# EAGLE schematic spinac (EAGLE 6.3)
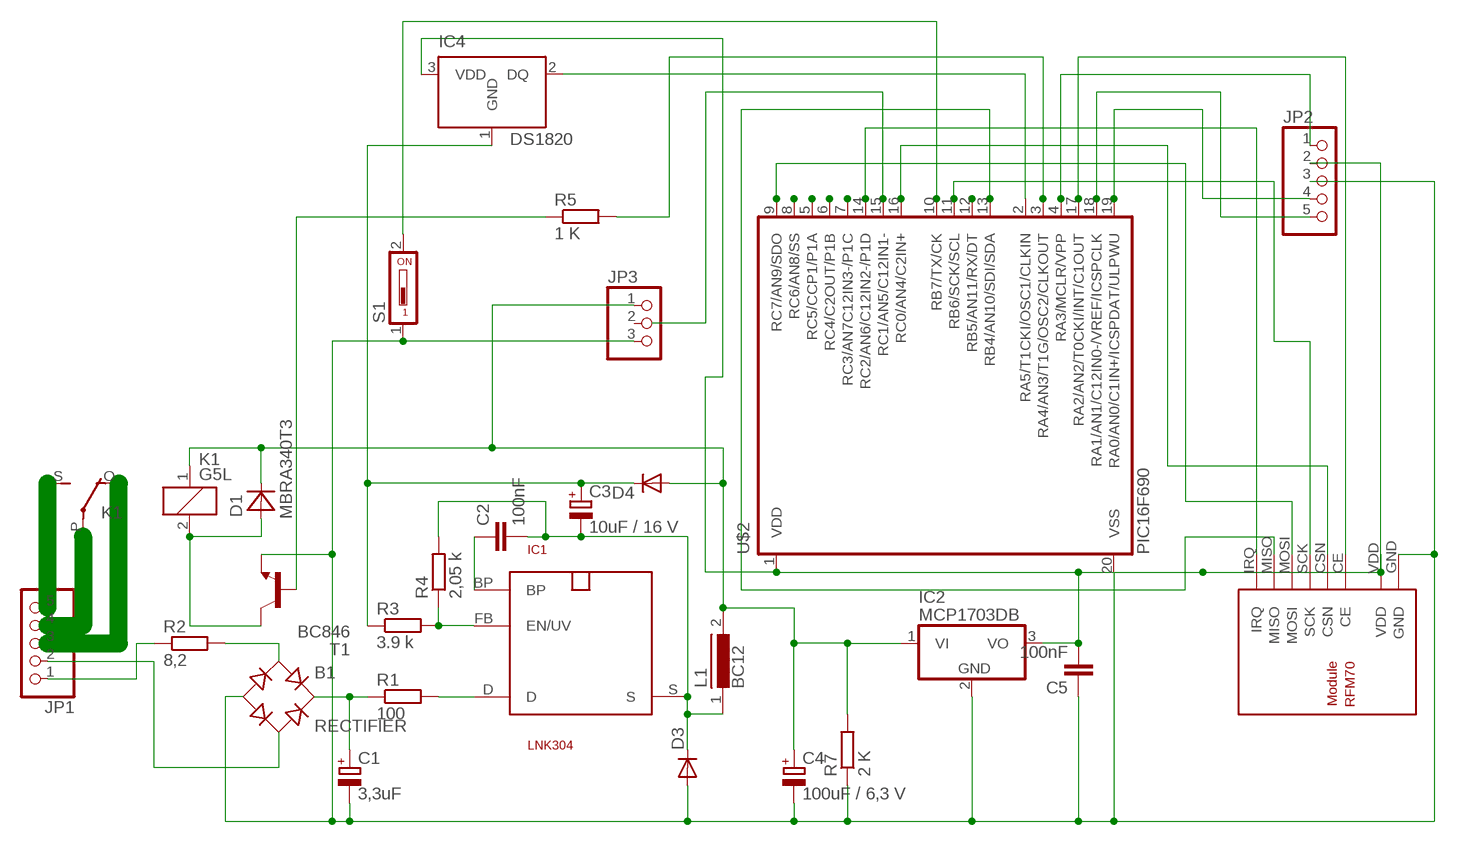
[diagram p0: schematic, sheet 1]

## Parts
B1  RECTIFIER  RECTIFIER-S40  [TO-269AA]
C1  3,3uF  CPOL-EUE5-13  [E5-13]
C2  100nF  C-EUC2012  [C2012]
C3  10uF / 16 V  CPOL-EUE2.5-5  [E2,5-5]
C4  100uF / 6,3 V  CPOL-EUE2.5-5  [E2,5-5]
C5  100nF  C-EUC2012  [C2012]
D1  MBRA340T3  [SMA]
D3  DIODE-DO214AA  [DO214AA]
D4  DIODE-DO214AA  [DO214AA]
IC1  LNK304  SO-8C  [SO-8C]
IC2  MCP1703DB  [SOT223]
IC4  DS1820  [TO-92]
JP1  PINHD-1X5  [1X05]
JP2  PINHD-1X5  [1X05]
JP3  PINHD-1X3  [1X03]
K1  G5L  [G5LE]
L1  BC12  [BC12]
R1  100  R-EU_R2512W  [R2512W]
R2  8,2  R-EU_R2512W  [R2512W]
R3  3.9 k  R-EU_M2012  [M2012]
R4  2,05 k  R-EU_M2012  [M2012]
R5  1 K  R-EU_M2012  [M2012]
R7  2 K  R-EU_M2012  [M2012]
S1  SD4-01  [SD4-01]
T1  BC846  [SOT23]
U$1  RFM70  [RFM70]
U$2  PIC16F690  [SSOP20]

## Nets
N$1: IC1.D R1.2
N$2: B1.+ C1.+ R1.1
N$3: B1.AC1 R2.2
N$4: B1.AC2 JP1.2
N$5: B1.- C1.- C4.- C5.1 D3.A IC2.2(GND) JP2.3 JP3.3 R7.1 S1.1 T1.2(E) U$1.GND U$2.20(VSS)
N$6: IC4.2(DQ) U$2.2(RA5/T1CKI/OSC1/CLKIN)
N$7: JP1.4 K1.P(2:P)
N$8: JP1.5 K1.S(2:S)
N$9: C3.+ D4.C IC4.1(GND) R3.1
N$10: C2.1 IC1.BP
N$11: IC1.FB(EN/UV) R3.2 R4.1
N$12: U$1.MISO U$2.13(RB4/AN10/SDI/SDA)
N$13: C2.2 C3.- D3.C IC1.S L1.1 R4.2
N$14: D1.A K1.2 T1.3(C)
N$15: R5.1 T1.1(B)
N$16: U$1.CE U$2.17(RA2/AN2/T0CKI/INT/C1OUT)
N$17: C5.2 IC2.3(VO) IC4.3(VDD) JP2.2 U$1.VDD U$2.1(VDD)
N$18: JP2.4 U$2.19(RA0/AN0/C1IN+/ICSPDAT/ULPWU)
N$19: JP2.5 U$2.18(RA1/AN1/C12IN0-/VREF/ICSPCLK)
N$20: U$1.CSN U$2.16(RC0/AN4/C2IN+)
N$21: U$1.IRQ U$2.14(RC2/AN6/C12IN2-/P1D)
N$22: U$1.SCK U$2.11(RB6/SCK/SCL)
N$23: U$1.MOSI U$2.9(RC7/AN9/SDO)
N$24: JP1.3 K1.O(2:O)
N$25: JP2.1 U$2.4(RA3/MCLR/VPP)
N$26: C4.+ D1.C D4.A IC2.1(VI) JP3.1 K1.1 L1.2 R7.2
N$28: U$2.8(RC6/AN8/SS)
N$29: U$2.5(RC5/CCP1/P1A)
N$30: U$2.6(RC4/C2OUT/P1B)
N$31: U$2.7(RC3/AN7C12IN3-/P1C)
N$32: U$2.15(RC1/AN5/C12IN1-)
N$33: S1.2 U$2.10(RB7/TX/CK)
N$34: U$2.12(RB5/AN11/RX/DT)
N$35: R5.2 U$2.3(RA4/AN3/T1G/OSC2/CLKOUT)
N$36: JP1.1 R2.1
Unconnected: JP3.2

## Library data of the parts
B1 = rectifier:RECTIFIER-: Rectifier
C1 C3 C4 = resistor:CPOL-EU: POLARIZED CAPACITOR, European symbol
C2 C5 = resistor:C-EU: CAPACITOR, European symbol
D1 = diode:MBRA340T3: Surface Mount Schottky Power Rectifier Source: http://www.onsemi.com/pub_link/Collateral/MBRA340T3-D.PDF
D3 D4 = diode:DIODE-: DIODE
IC1 = powerint:SO-8C: 700V MOSFET für Schaltnetz-Trafos. Pin 3 fehlt. SMD
IC2 = linear:MCP1703: 250 mA, 16V, Low Quiescent Current LDO Regulator Source: http://ww1.microchip.com/downloads/en/DeviceDoc/22049b.pdf
IC4 = ds1820:DS1820: DS1820 - 1-Wire Digital Thermometer
JP1 JP2 = pinhead:PINHD-1X5: PIN HEADER
JP3 = pinhead:PINHD-1X3: PIN HEADER
K1 = relay:G5L: RELAY 1 x switch, 10 A/120 V AC, 8 A/30 V ADC, Omron; OC_FARNELL: unknown; OC_NEWARK: unknown
L1 = inductors:BC12: INDUCTOR
R1-R5 R7 = resistor:R-EU_: RESISTOR, European symbol
S1 = switch-dil:SD4-01: DIL/CODE SWITCH; OC_FARNELL: unknown; OC_NEWARK: unknown
T1 = transistor:BC846: NPN TRANSISTOR
U$1 = rfm70:RFM70: RFM70 2.4 Ghz Funkmodul Autor: Daniel Weber Website: http://projects.web4clans.com Email: daniel.weber@web4clans.com
U$2 = microchip:PIC16F690*: MICROCONTROLLER PIC16F690 18 I/O One 16-bit timer Two 8-bit timer Two comparators Precision internal oscillator-software selectable 8 MHz - 32 KHz SSP w/ I2C Compatible Address mask option EUSART LIN 2.0 Compatible ECCP+ w/ PWM Steering 12 A/D Channels ULPW Enhanced Low Power Timer 1 Timer 1 Gate Synch Latch 4k Program Flash memory 256 bytes SRAM 256 bytes EEPROM